# Altium schematic sheet Connector_0_V1_01.SchDoc
size A2; Date: Date; CompanyName: HESSO; Engineer: Name; Address1: Route du Rawyl 47; Address2: 1950 Sion; Address3: Switzerland; SheetNumber: 1; SheetTotal: 6; ProjectName: Project Name
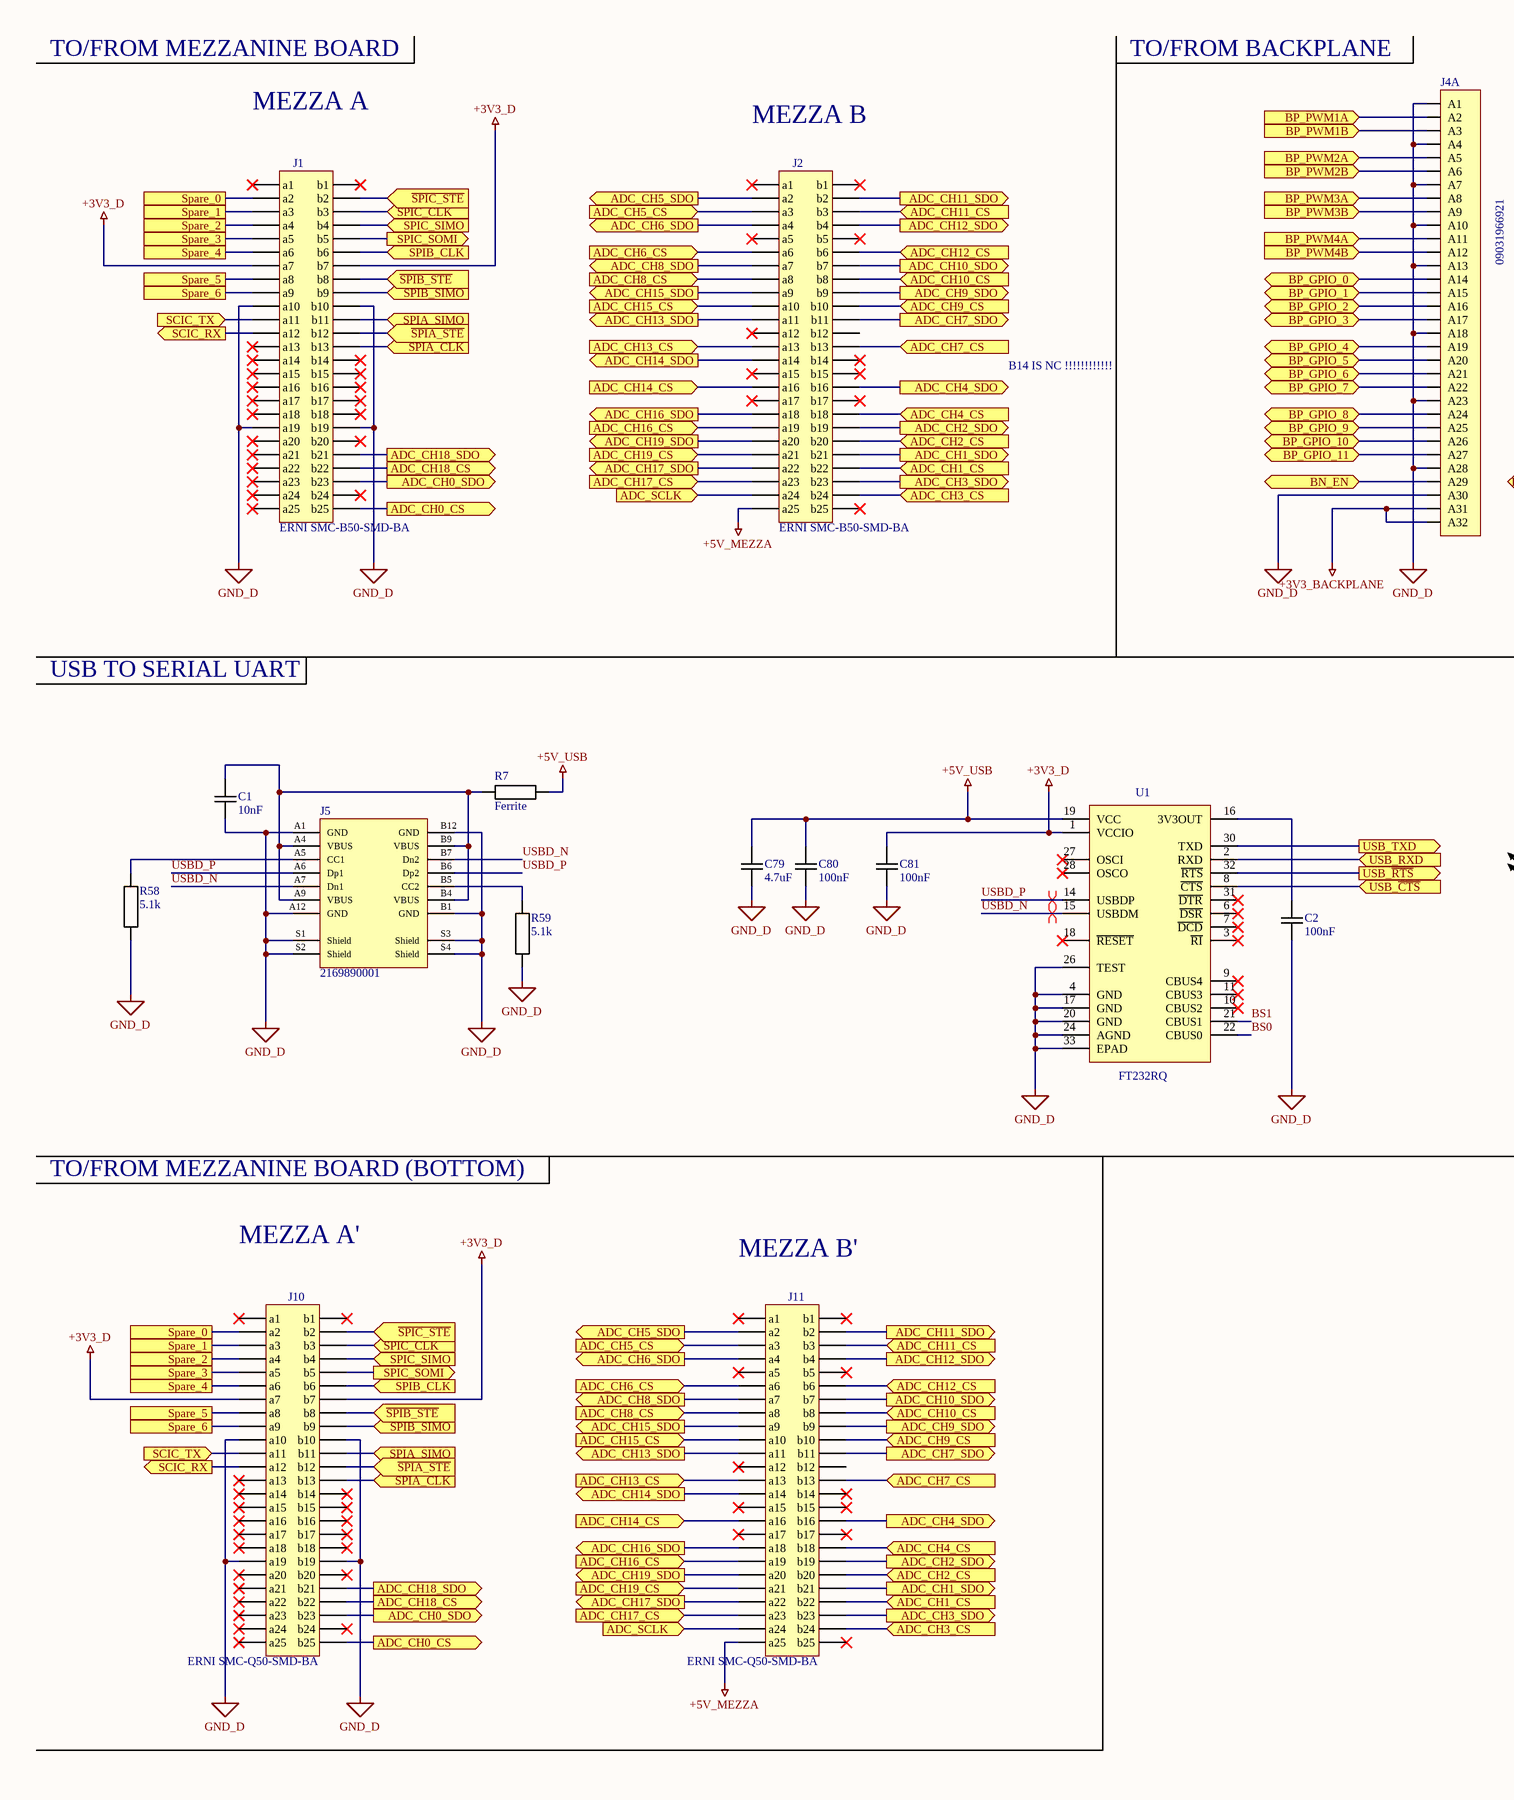
[diagram p0: Connector_0_V1_01.SchDoc, left]
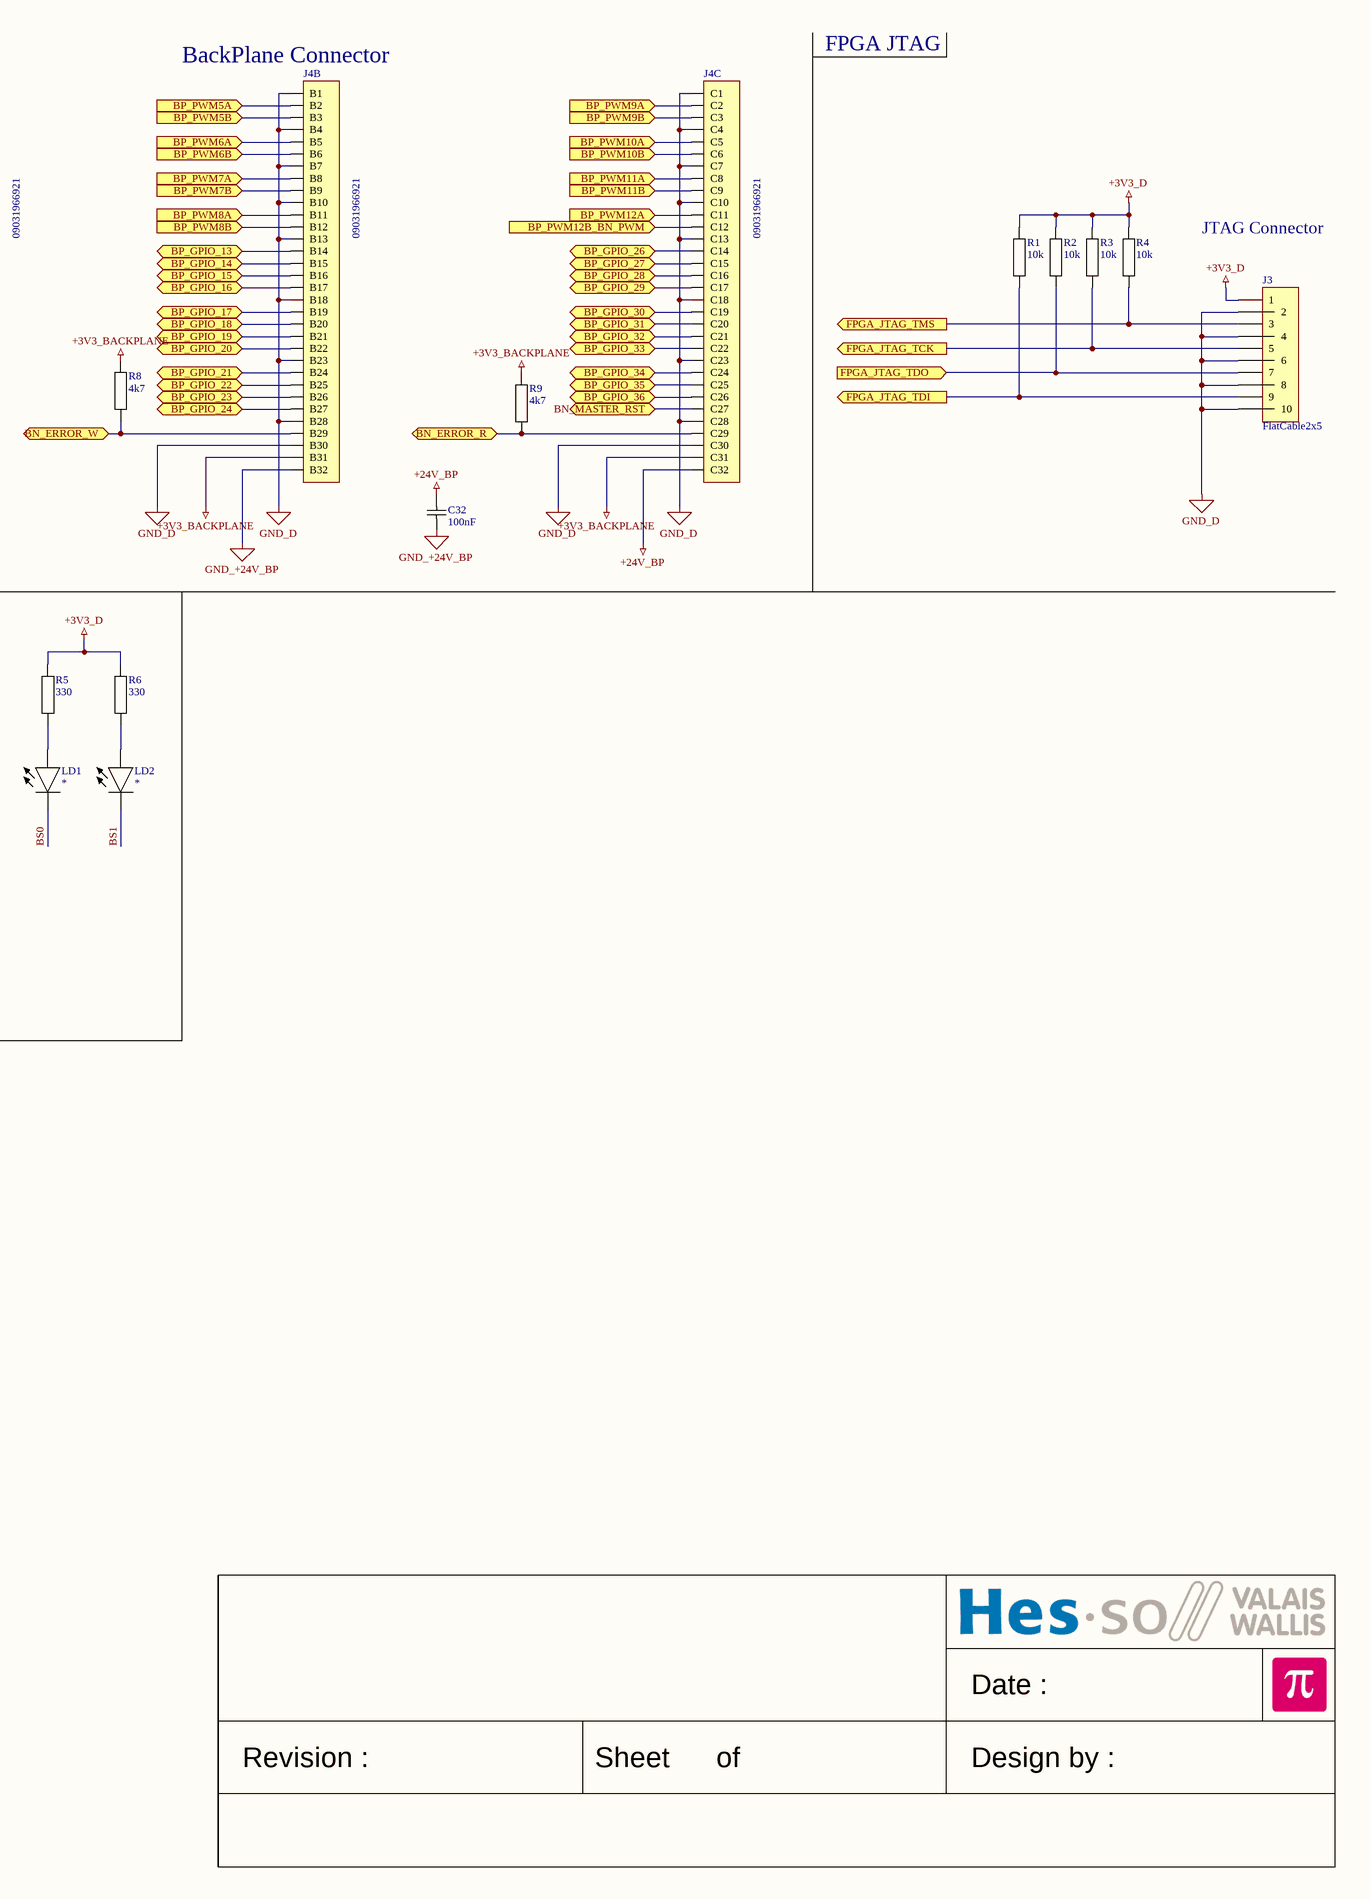
[diagram p1: Connector_0_V1_01.SchDoc, right]

## Parts
C1  10nF  [CAPACITOR 1608 REFLOW]
C2  100nF  [CAPACITOR 1608 REFLOW]
C32  100nF  [CAPACITOR 1608 REFLOW]
C79  4.7uF  [CAPACITOR 1608 REFLOW]
C80  100nF  [CAPACITOR 1608 REFLOW]
C81  100nF  [CAPACITOR 1608 REFLOW]
J1  ERNI SMC-B50-SMD-BA  [ERNI SMC-B50-SMD-BA]
J2  ERNI SMC-B50-SMD-BA  [ERNI SMC-B50-SMD-BA]
J3  FlatCable2x5  [FlatCable2x5 2MM Right Angle TH FCI 98614-G61-10ULF]
J4  09031966921  [DIN41612 MALE 3X32 ABC R90]  (parts A,B,C of 3)
J5  2169890001  [USB-C-TH MOLEX 2169890001]
J10  ERNI SMC-Q50-SMD-BA  [ERNI SMC-Q50-SMD-BA]
J11  ERNI SMC-Q50-SMD-BA  [ERNI SMC-Q50-SMD-BA]
LD1  *  [LED 1608 REFLOW]
LD2  *  [LED 1608 REFLOW]
R1  10k  [RESISTOR 1608 REFLOW]
R2  10k  [RESISTOR 1608 REFLOW]
R3  10k  [RESISTOR 1608 REFLOW]
R4  10k  [RESISTOR 1608 REFLOW]
R5  330  [RESISTOR 1608 REFLOW]
R6  330  [RESISTOR 1608 REFLOW]
R7  Ferrite  [RESISTOR 1608 REFLOW]
R8  4k7  [RESISTOR 1608 REFLOW]
R9  4k7  [RESISTOR 1608 REFLOW]
R58  5.1k  [RESISTOR 1608 REFLOW]
R59  5.1k  [RESISTOR 1608 REFLOW]
U1  FT232RQ  [QFN32 P0.5 T3.2x3.2 C5.0X5.0 H1.0]

## Ports
ADC_CH0_CS (out), ADC_CH0_SDO (out), ADC_CH1_CS (in), ADC_CH1_SDO (out), ADC_CH2_CS (in), ADC_CH2_SDO (out), ADC_CH3_CS (in), ADC_CH3_SDO (out), ADC_CH4_CS (in), ADC_CH4_SDO (out), ADC_CH5_CS (in), ADC_CH5_SDO (out), ADC_CH6_CS (in), ADC_CH6_SDO (out), ADC_CH7_CS (in), ADC_CH7_SDO (out), ADC_CH8_CS (in), ADC_CH8_SDO (out), ADC_CH9_CS (in), ADC_CH9_SDO (out), ADC_CH10_CS (in), ADC_CH10_SDO (out), ADC_CH11_CS (in), ADC_CH11_SDO (out), ADC_CH12_CS (in), ADC_CH12_SDO (out), ADC_CH13_CS (in), ADC_CH13_SDO (out), ADC_CH14_CS (in), ADC_CH14_SDO (out), ADC_CH15_CS (in), ADC_CH15_SDO (out), ADC_CH16_CS (in), ADC_CH16_SDO (out), ADC_CH17_CS (in), ADC_CH17_SDO (out), ADC_CH18_CS (out), ADC_CH18_SDO (out), ADC_CH19_CS (in), ADC_CH19_SDO (out), ADC_SCLK (in), BN_EN (bidir), BN_ERROR_R (bidir), BN_ERROR_W (bidir), BN_MASTER_RST (bidir), BP_GPIO_0 (bidir), BP_GPIO_1 (bidir), BP_GPIO_2 (bidir), BP_GPIO_3 (bidir), BP_GPIO_4 (bidir), BP_GPIO_5 (bidir), BP_GPIO_6 (bidir), BP_GPIO_7 (bidir), BP_GPIO_8 (bidir), BP_GPIO_9 (bidir), BP_GPIO_10 (bidir), BP_GPIO_11 (bidir), BP_GPIO_13 (bidir), BP_GPIO_14 (bidir), BP_GPIO_15 (bidir), BP_GPIO_16 (bidir), BP_GPIO_17 (bidir), BP_GPIO_18 (bidir), BP_GPIO_19 (bidir), BP_GPIO_20 (bidir), BP_GPIO_21 (bidir), BP_GPIO_22 (bidir), BP_GPIO_23 (bidir), BP_GPIO_24 (bidir), BP_GPIO_26 (bidir), BP_GPIO_27 (bidir), BP_GPIO_28 (bidir), BP_GPIO_29 (bidir), BP_GPIO_30 (bidir), BP_GPIO_31 (bidir), BP_GPIO_32 (bidir), BP_GPIO_33 (bidir), BP_GPIO_34 (bidir), BP_GPIO_35 (bidir), BP_GPIO_36 (bidir), BP_PWM1A (in), BP_PWM1B (in), BP_PWM2A (in), BP_PWM2B (in), BP_PWM3A (in), BP_PWM3B (in), BP_PWM4A (in), BP_PWM4B (in), BP_PWM5A (in), BP_PWM5B (in), BP_PWM6A (in), BP_PWM6B (in), BP_PWM7A (in), BP_PWM7B (in), BP_PWM8A (in), BP_PWM8B (in), BP_PWM9A (in), BP_PWM9B (in), BP_PWM10A (in), BP_PWM10B (in), BP_PWM11A (in), BP_PWM11B (in), BP_PWM12A (in), BP_PWM12B_BN_PWM (in), FPGA_JTAG_TCK (out), FPGA_JTAG_TDI (out), FPGA_JTAG_TDO (in), FPGA_JTAG_TMS (out), SCIC_RX (out), SCIC_TX (in), Spare_0, Spare_1, Spare_2, Spare_3, Spare_4, Spare_5, Spare_6, SPIA_CLK (in), SPIA_SIMO (in), SPIB_CLK (in), SPIB_SIMO (in), SPIC_CLK (in), SPIC_SIMO (in), SPIC_SOMI (out), USB_RXD (in), USB_TXD (out), USB_~{CTS} (in), USB_~{RTS} (out), ~{SPIA_STE} (in), ~{SPIB_STE} (in), ~{SPIC_STE} (in)

## Nets
+3V3_BACKPLANE: J4.A31 J4.A32 J4.B31 J4.C31 R8.2 R9.2
+3V3_D: C81.2 J1.a7 J1.b7 J3.1 J10.a7 J10.b7 R1.2 R2.2 R3.2 R4.2 R5.2 R6.2 U1.1(VCCIO)
+5V_MEZZA: J2.a25 J11.a25
+5V_USB: C79.2 C80.2 R7.2 U1.19(VCC)
+24V_BP: C32.2 J4.C32
GND_+24V_BP: C32.1 J4.B32
GND_D: C1.1 C2.1 C79.1 C80.1 C81.1 J1.a10 J1.a19 J1.b10 J1.b19 J3.2 J3.4 J3.6 J3.8 J3.10 J4.A1 J4.A4 J4.A7 J4.A10 J4.A13 J4.A18 J4.A23 J4.A28 J4.A30 J4.B1 J4.B4 J4.B7 J4.B10 J4.B13 J4.B18 J4.B23 J4.B28 J4.B30 J4.C1 J4.C4 J4.C7 J4.C10 J4.C13 J4.C18 J4.C23 J4.C28 J4.C30 J5.A1(GND) J5.A12(GND) J5.B1(GND) J5.B12(GND) J5.S1(Shield) J5.S2(Shield) J5.S3(Shield) J5.S4(Shield) J10.a10 J10.a19 J10.b10 J10.b19 R58.2 R59.2 U1.4(GND) U1.17(GND) U1.20(GND) U1.24(AGND) U1.26(TEST) U1.33(EPAD)
~{SPIA_STE}: J1.b12 J10.b12 ; port ~{SPIA_STE}
~{SPIB_STE}: J1.b8 J10.b8 ; port ~{SPIB_STE}
~{SPIC_STE}: J1.b2 J10.b2 ; port ~{SPIC_STE}
ADC_CH0_CS: J1.b25 J10.b25 ; port ADC_CH0_CS
ADC_CH0_SDO: J1.b23 J10.b23 ; port ADC_CH0_SDO
ADC_CH1_CS: J2.b22 J11.b22 ; port ADC_CH1_CS
ADC_CH1_SDO: J2.b21 J11.b21 ; port ADC_CH1_SDO
ADC_CH2_CS: J2.b20 J11.b20 ; port ADC_CH2_CS
ADC_CH2_SDO: J2.b19 J11.b19 ; port ADC_CH2_SDO
ADC_CH3_CS: J2.b24 J11.b24 ; port ADC_CH3_CS
ADC_CH3_SDO: J2.b23 J11.b23 ; port ADC_CH3_SDO
ADC_CH4_CS: J2.b18 J11.b18 ; port ADC_CH4_CS
ADC_CH4_SDO: J2.b16 J11.b16 ; port ADC_CH4_SDO
ADC_CH5_CS: J2.a3 J11.a3 ; port ADC_CH5_CS
ADC_CH5_SDO: J2.a2 J11.a2 ; port ADC_CH5_SDO
ADC_CH6_CS: J2.a6 J11.a6 ; port ADC_CH6_CS
ADC_CH6_SDO: J2.a4 J11.a4 ; port ADC_CH6_SDO
ADC_CH7_CS: J2.b13 J11.b13 ; port ADC_CH7_CS
ADC_CH7_SDO: J2.b11 J11.b11 ; port ADC_CH7_SDO
ADC_CH8_CS: J2.a8 J11.a8 ; port ADC_CH8_CS
ADC_CH8_SDO: J2.a7 J11.a7 ; port ADC_CH8_SDO
ADC_CH9_CS: J2.b10 J11.b10 ; port ADC_CH9_CS
ADC_CH9_SDO: J2.b9 J11.b9 ; port ADC_CH9_SDO
ADC_CH10_CS: J2.b8 J11.b8 ; port ADC_CH10_CS
ADC_CH10_SDO: J2.b7 J11.b7 ; port ADC_CH10_SDO
ADC_CH11_CS: J2.b3 J11.b3 ; port ADC_CH11_CS
ADC_CH11_SDO: J2.b2 J11.b2 ; port ADC_CH11_SDO
ADC_CH12_CS: J2.b6 J11.b6 ; port ADC_CH12_CS
ADC_CH12_SDO: J2.b4 J11.b4 ; port ADC_CH12_SDO
ADC_CH13_CS: J2.a13 J11.a13 ; port ADC_CH13_CS
ADC_CH13_SDO: J2.a11 J11.a11 ; port ADC_CH13_SDO
ADC_CH14_CS: J2.a16 J11.a16 ; port ADC_CH14_CS
ADC_CH14_SDO: J2.a14 J11.a14 ; port ADC_CH14_SDO
ADC_CH15_CS: J2.a10 J11.a10 ; port ADC_CH15_CS
ADC_CH15_SDO: J2.a9 J11.a9 ; port ADC_CH15_SDO
ADC_CH16_CS: J2.a19 J11.a19 ; port ADC_CH16_CS
ADC_CH16_SDO: J2.a18 J11.a18 ; port ADC_CH16_SDO
ADC_CH17_CS: J2.a23 J11.a23 ; port ADC_CH17_CS
ADC_CH17_SDO: J2.a22 J11.a22 ; port ADC_CH17_SDO
ADC_CH18_CS: J1.b22 J10.b22 ; port ADC_CH18_CS
ADC_CH18_SDO: J1.b21 J10.b21 ; port ADC_CH18_SDO
ADC_CH19_CS: J2.a21 J11.a21 ; port ADC_CH19_CS
ADC_CH19_SDO: J2.a20 J11.a20 ; port ADC_CH19_SDO
ADC_SCLK: J2.a24 J11.a24 ; port ADC_SCLK
BN_EN: J4.A29 ; port BN_EN
BN_ERROR_R: J4.C29 R9.1 ; port BN_ERROR_R
BN_ERROR_W: J4.B29 R8.1 ; port BN_ERROR_W
BN_MASTER_RST: J4.C27 ; port BN_MASTER_RST
BP_GPIO_0: J4.A14 ; port BP_GPIO_0
BP_GPIO_1: J4.A15 ; port BP_GPIO_1
BP_GPIO_2: J4.A16 ; port BP_GPIO_2
BP_GPIO_3: J4.A17 ; port BP_GPIO_3
BP_GPIO_4: J4.A19 ; port BP_GPIO_4
BP_GPIO_5: J4.A20 ; port BP_GPIO_5
BP_GPIO_6: J4.A21 ; port BP_GPIO_6
BP_GPIO_7: J4.A22 ; port BP_GPIO_7
BP_GPIO_8: J4.A24 ; port BP_GPIO_8
BP_GPIO_9: J4.A25 ; port BP_GPIO_9
BP_GPIO_10: J4.A26 ; port BP_GPIO_10
BP_GPIO_11: J4.A27 ; port BP_GPIO_11
BP_GPIO_13: J4.B14 ; port BP_GPIO_13
BP_GPIO_14: J4.B15 ; port BP_GPIO_14
BP_GPIO_15: J4.B16 ; port BP_GPIO_15
BP_GPIO_16: J4.B17 ; port BP_GPIO_16
BP_GPIO_17: J4.B19 ; port BP_GPIO_17
BP_GPIO_18: J4.B20 ; port BP_GPIO_18
BP_GPIO_19: J4.B21 ; port BP_GPIO_19
BP_GPIO_20: J4.B22 ; port BP_GPIO_20
BP_GPIO_21: J4.B24 ; port BP_GPIO_21
BP_GPIO_22: J4.B25 ; port BP_GPIO_22
BP_GPIO_23: J4.B26 ; port BP_GPIO_23
BP_GPIO_24: J4.B27 ; port BP_GPIO_24
BP_GPIO_26: J4.C14 ; port BP_GPIO_26
BP_GPIO_27: J4.C15 ; port BP_GPIO_27
BP_GPIO_28: J4.C16 ; port BP_GPIO_28
BP_GPIO_29: J4.C17 ; port BP_GPIO_29
BP_GPIO_30: J4.C19 ; port BP_GPIO_30
BP_GPIO_31: J4.C20 ; port BP_GPIO_31
BP_GPIO_32: J4.C21 ; port BP_GPIO_32
BP_GPIO_33: J4.C22 ; port BP_GPIO_33
BP_GPIO_34: J4.C24 ; port BP_GPIO_34
BP_GPIO_35: J4.C25 ; port BP_GPIO_35
BP_GPIO_36: J4.C26 ; port BP_GPIO_36
BP_PWM1A: J4.A2 ; port BP_PWM1A
BP_PWM1B: J4.A3 ; port BP_PWM1B
BP_PWM2A: J4.A5 ; port BP_PWM2A
BP_PWM2B: J4.A6 ; port BP_PWM2B
BP_PWM3A: J4.A8 ; port BP_PWM3A
BP_PWM3B: J4.A9 ; port BP_PWM3B
BP_PWM4A: J4.A11 ; port BP_PWM4A
BP_PWM4B: J4.A12 ; port BP_PWM4B
BP_PWM5A: J4.B2 ; port BP_PWM5A
BP_PWM5B: J4.B3 ; port BP_PWM5B
BP_PWM6A: J4.B5 ; port BP_PWM6A
BP_PWM6B: J4.B6 ; port BP_PWM6B
BP_PWM7A: J4.B8 ; port BP_PWM7A
BP_PWM7B: J4.B9 ; port BP_PWM7B
BP_PWM8A: J4.B11 ; port BP_PWM8A
BP_PWM8B: J4.B12 ; port BP_PWM8B
BP_PWM9A: J4.C2 ; port BP_PWM9A
BP_PWM9B: J4.C3 ; port BP_PWM9B
BP_PWM10A: J4.C5 ; port BP_PWM10A
BP_PWM10B: J4.C6 ; port BP_PWM10B
BP_PWM11A: J4.C8 ; port BP_PWM11A
BP_PWM11B: J4.C9 ; port BP_PWM11B
BP_PWM12A: J4.C11 ; port BP_PWM12A
BP_PWM12B_BN_PWM: J4.C12 ; port BP_PWM12B_BN_PWM
BS0: LD1.1(C) U1.22(CBUS0)
BS1: LD2.1(C) U1.21(CBUS1)
FPGA_JTAG_TCK: J3.5 R3.1 ; port FPGA_JTAG_TCK
FPGA_JTAG_TDI: J3.9 R1.1 ; port FPGA_JTAG_TDI
FPGA_JTAG_TDO: J3.7 R2.1 ; port FPGA_JTAG_TDO
FPGA_JTAG_TMS: J3.3 R4.1 ; port FPGA_JTAG_TMS
SCIC_RX: J1.a12 J10.a12 ; port SCIC_RX
SCIC_TX: J1.a11 J10.a11 ; port SCIC_TX
Spare_0: J1.a2 J10.a2 ; port Spare_0
Spare_1: J1.a3 J10.a3 ; port Spare_1
Spare_2: J1.a4 J10.a4 ; port Spare_2
Spare_3: J1.a5 J10.a5 ; port Spare_3
Spare_4: J1.a6 J10.a6 ; port Spare_4
Spare_5: J1.a8 J10.a8 ; port Spare_5
Spare_6: J1.a9 J10.a9 ; port Spare_6
SPIA_CLK: J1.b13 J10.b13 ; port SPIA_CLK
SPIA_SIMO: J1.b11 J10.b11 ; port SPIA_SIMO
SPIB_CLK: J1.b6 J10.b6 ; port SPIB_CLK
SPIB_SIMO: J1.b9 J10.b9 ; port SPIB_SIMO
SPIC_CLK: J1.b3 J10.b3 ; port SPIC_CLK
SPIC_SIMO: J1.b4 J10.b4 ; port SPIC_SIMO
SPIC_SOMI: J1.b5 J10.b5 ; port SPIC_SOMI
USB_~{CTS}: U1.8(~{CTS}) ; port USB_~{CTS}
USB_~{RTS}: U1.32(~{RTS}) ; port USB_~{RTS}
USB_RXD: U1.2(RXD) ; port USB_RXD
USB_TXD: U1.30(TXD) ; port USB_TXD
USBD_N: J5.A7(Dn1) J5.B7(Dn2) U1.15(USBDM)
USBD_P: J5.A6(Dp1) J5.B6(Dp2) U1.14(USBDP)
NetC1_2: C1.2 J5.A4(VBUS) J5.A9(VBUS) J5.B4(VBUS) J5.B9(VBUS) R7.1
NetC2_2: C2.2 U1.16(3V3OUT)
NetJ5_A5: J5.A5(CC1) R58.1
NetJ5_B5: J5.B5(CC2) R59.1
NetLD1_2: LD1.2(A) R5.1
NetLD2_2: LD2.2(A) R6.1

Not connected (* = marked no-connect by the designer): J1 a1* a13* a14* a15* a16* a17* a18* a20* a21* a22* a23* a24* a25* b1* b14* b15* b16* b17* b18* b20* b24*; J2 a1* a5* a12* a15* a17* b1* b5* b12 b14* b15* b17* b25*; J10 a1* a13* a14* a15* a16* a17* a18* a20* a21* a22* a23* a24* a25* b1* b14* b15* b16* b17* b18* b20* b24*; J11 a1* a5* a12* a15* a17* b1* b5* b12 b14* b15* b17* b25*; U1 3(~{RI})* 5 6(~{DSR})* 7(~{DCD})* 9(CBUS4)* 10(CBUS2)* 11(CBUS3)* 12 13 18(~{RESET})* 23 25 27(OSCI)* 28(OSCO)* 29 31(~{DTR})*

## Layout directives
differential pair: USBD_N, USBD_P

## Notes on the sheet
- TO/FROM MEZZANINE BOARD
- MEZZA A
- TO/FROM BACKPLANE
- (near J4) BackPlane Connector
- FPGA JTAG
- MEZZA B
- JTAG Connector
- B14 IS NC !!!!!!!!!!!!
- USB TO SERIAL UART
- TO/FROM MEZZANINE BOARD (BOTTOM)
- MEZZA A'
- MEZZA B'
- Date :
- Revision :
- Sheet
- of
- Design by :

## Library data of the parts
C1 C2 C32 C79-C81 = Capacitor: Capacitor X7R 10% 50V 1608(0603)
  C1: Value: 10nF
  C2 C32 C80 C81: Value: 100nF
  C79: Value: 4.7uF
J1 J2 = ERNI SMC-B50-SMD-BA: Female 1.27 pitch 2x25 pin connector
J4 = DIN41612 MALE 3X32 ABC R90: Manufacturer: Harting; Mouser No.: 617-09-03-196-6921; Value: 09031966921
J5 = USB-C-Molex 2169890001: USB-C Receptacle Connector 24 Position Through Hole, Right Angle; ComponentLink1Description: Manufacturer; ComponentLink1URL: http://www.we-online.de; ComponentLink2Description: Datasheet; ComponentLink2URL: https://katalog.we-online.com/em/datasheet/632722110112.pdf; Value: 2169890001
J10 J11 = ERNI SMC-Q50-SMD-BA: Male 1.27 pitch 2x25 pin connector
LD1 LD2 = LED: LED generic; Value: *
R1-R4 R7-R9 R58 R59 = Resistor: Resistor 1% 50V 100mW 1608(0603)
  R1-R4: Value: 10k
  R7: Value: Ferrite
  R8 R9: Value: 4k7
  R58 R59: Value: 5.1k
R5 R6 = Resistor: Resistor 1% 50V 125mW 2012(0805); Value: 330
U1 = FT232RQ: 24-Bit ADC with Ultra Low Noise PGIA - Crystal; Value: FT232RQ